# EAGLE design MagSwitchRev1_1 (EAGLE 7.2.0)
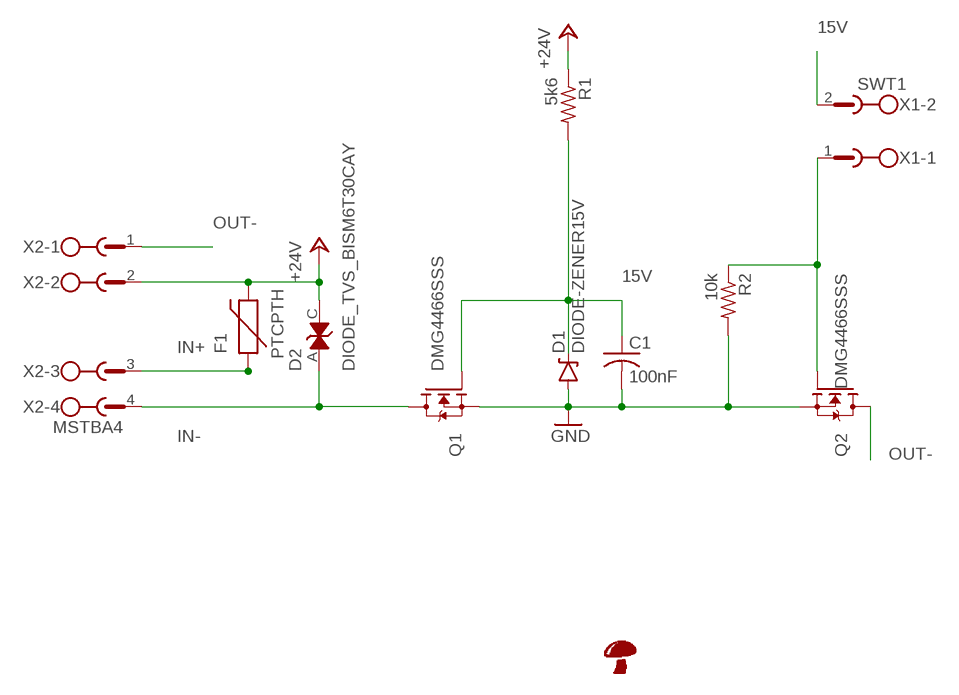
[diagram p0: schematic, sheet 1]

## Parts
C1  100nF  C-USC0805  [C0805]
D1  DIODE-ZENER15V  [SOD-323]
D2  DIODE_TVS_BISM6T30CAY  [SMB-DIODE]
F1  PTCPTH  [PTC]
Q1  DMG4466SSS  [SO08]
Q2  DMG4466SSS  [SO08]
R1  5k6  R-US_M0805  [M0805]
R2  10k  R-US_M0805  [M0805]
U$4  SHROOM5MM  [SHROOM]
X1  SWT1  MSTBA2  [MSTBA2]
X2  MSTBA4  [MSTBA4]

## Nets
15V: C1.1 D1.C Q1.4(G) R1.2 X1.2
+24V: D2.C F1.P$2 R1.1 X2.2
GND: C1.2 D1.A Q1.1(S) Q1.2(S) Q1.3(S) Q2.1(S) Q2.2(S) Q2.3(S) R2.2
IN+: F1.P$1 X2.3
IN-: D2.A Q1.5(D) Q1.6(D) Q1.7(D) Q1.8(D) X2.4
N$4: Q2.4(G) R2.1 X1.1
OUT-: Q2.5(D) Q2.6(D) Q2.7(D) Q2.8(D) X2.1

## Library data of the parts
C1 = resistor:C-US: CAPACITOR, American symbol
D1 = RobThePyro:DIODE-ZENER: ON Semiconductor MM3Z15VST1G Zener Diode, 15V 300 mW SMT 2-Pin SOD-323 RS stock no.802-4568ManufacturerON Semiconductor Mfr. Part No.MM3Z15VST1G
D2 = RobThePyro:DIODE_TVS_BI: STMicroelectronics SM6T30CAY Bi-Directional TVS Diode, 600W peak, 2-Pin DO-214AA RS stock no. 795-8877 Brand STMicroelectronics Mfr. Part No. SM6T30CAY
F1 = SparkFun-PowerIC:PTC: Resettable Fuse PTC Resettable Fuse. Spark Fun Electronics SKU : COM-08357
Q1 Q2 = RobThePyro:DMG4466SSS
R1 R2 = resistor:R-US_: RESISTOR, American symbol
U$4 = RobThePyro:SHROOM
X1 = con-phoenix-508:MSTBA2: PHOENIX; MF: FARNELL; MPN: 1757242; OC_FARNELL: 3705171; OC_NEWARK: 71C4161
X2 = con-phoenix-508:MSTBA4: PHOENIX; MF: FARNELL; MPN: 1757268; OC_FARNELL: 3705195; OC_NEWARK: 71C4163

## Board
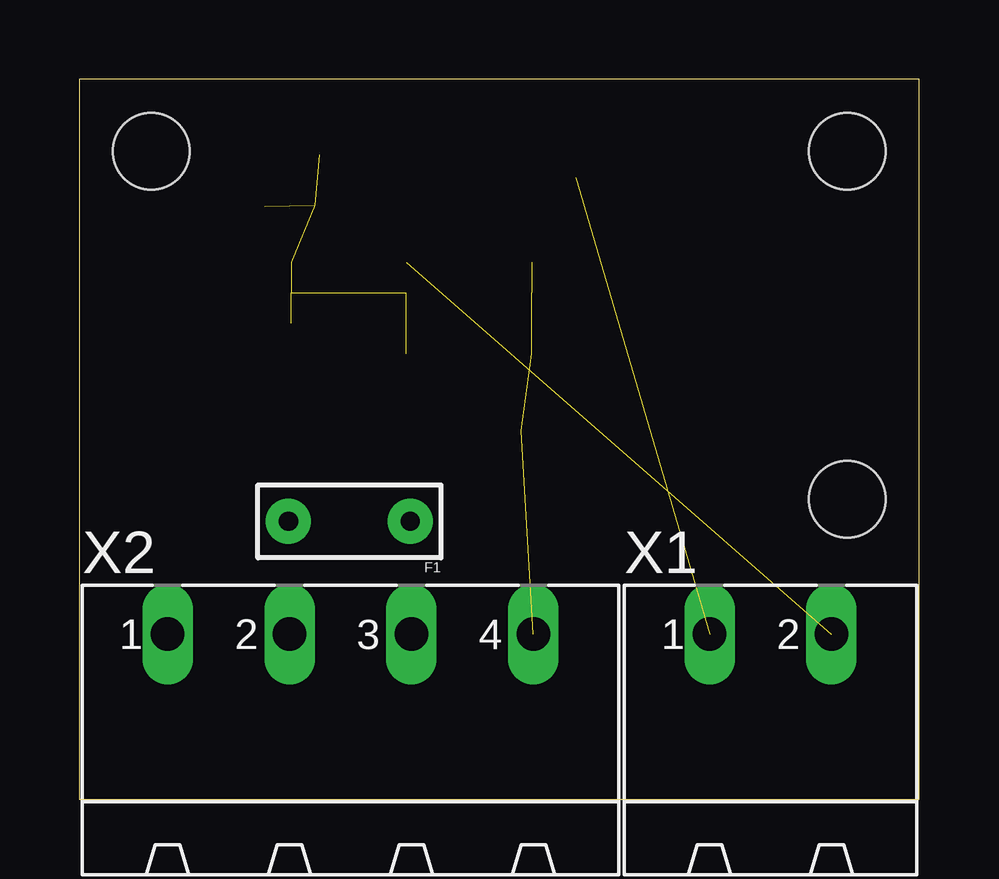
[diagram p1: board, top side]
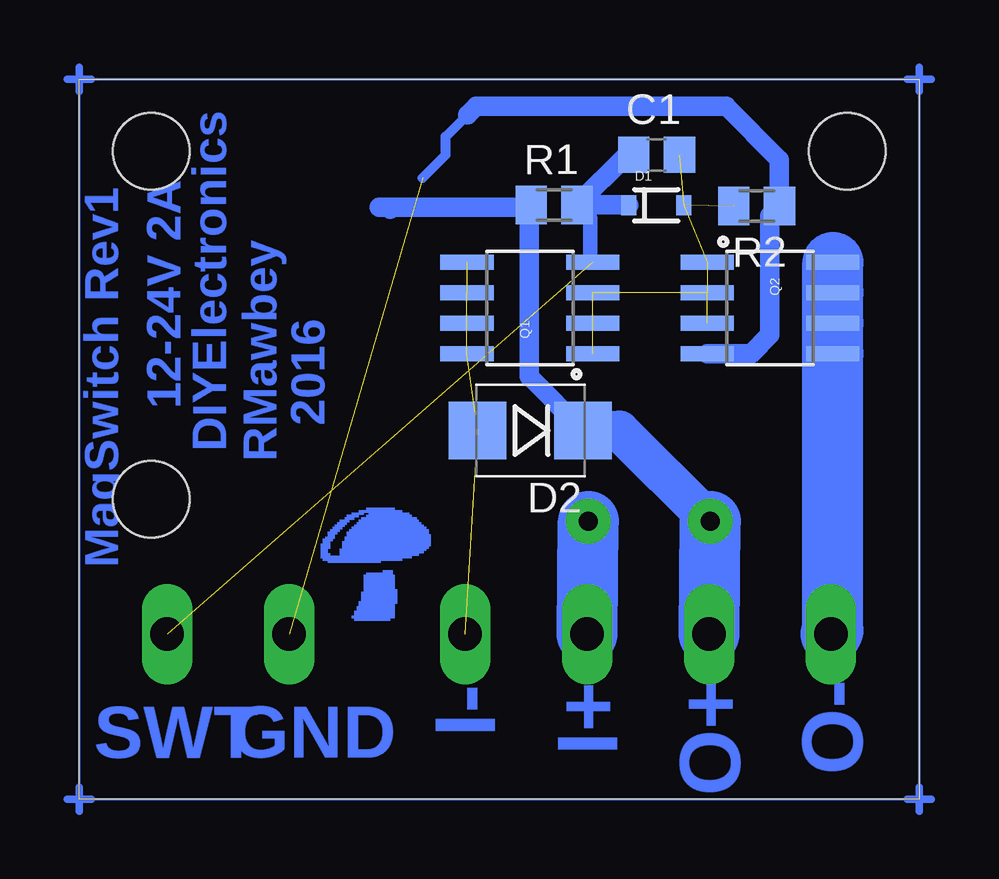
[diagram p2: board, bottom side, seen from below]

Size 35 x 30 mm. Coordinates in mm from the lower left corner, seen from the top.
Outline: 0,0 35,0 35,30 0,30 0,0
Copper layers (1*16): Top 0.035mm / dielectric 1.5mm / Bottom 0.035mm
Design rules "default": minimum track width 10mil, minimum drill 24mil, track to track 8mil, track to pad 8mil, pad to pad 8mil, via to via 8mil, smd to smd 8mil, copper to edge 40mil, drill to drill 8mil, minimum pad ring 10mil, minimum via ring 8mil, stop-mask expansion 4mil, vias tented up to drill 0mil, thermal gap 10mil
Holes 3.2 mm at 3,27 32,27 32,12.5

### Footprints (pad centres in the part's own frame; a part is rotated, then mirrored left to right if it is on the bottom)
C0805 = smd 1.3 x 1.5: 1 -0.95,0; 2 0.95,0
SOD-323 = smd 0.63 x 0.83: A 1.15,0; C -1.15,0
SMB-DIODE = smd 2.4 x 2.4: A 2.2,0; C -2.2,0
PTC = drill 0.8 pad 1.88: P$1 -2.54,0; P$2 2.54,0
SO08 = smd 0.61 x 2.21: 1 -1.905,-2.616; 2 -0.635,-2.616; 3 0.635,-2.616; 4 1.905,-2.616; 5 1.905,2.616; 6 0.635,2.616; 7 -0.635,2.616; 8 -1.905,2.616
M0805 = smd 1.3 x 1.6: 1 -0.95,0; 2 0.95,0
MSTBA2 = drill 1.397 long: 1 -2.54,5.08; 2 2.54,5.08
MSTBA4 = drill 1.397 long: 1 -7.62,5.08; 2 -2.54,5.08; 3 2.54,5.08; 4 7.62,5.08

### Placement (x,y rotation side)
C1  10.95,26.85 0 bottom
D1  10.96,24.75 0 bottom
D2  16.21,15.37 180 bottom
F1  11.25,11.58 180 top
Q1  16.23,20.47 90 bottom
Q2  6.22,20.47 270 bottom
R1  15.21,24.77 0 bottom
R2  6.78,24.72 180 bottom
U$4  25,7.5 0 bottom
X1  28.8,1.8 0 top
X2  11.3,1.8 0 top

### Tracks (layer width: path | path; a pad name or v marks a point on that pad's centre or on a via)
15V  (1 unrouted)
  Bottom 0.61: R1.2 13.72,24.22 13.72,22.48 Q1.4
  Bottom 0.813: D1.C 12.12,24.77 R1.2 12.18,26.85 C1.1
+24V
  Bottom 0.813: 16.26,24.67 R1.1 | 16.26,24.67 21.95,24.67 | 21.95,24.67 22.5,24.67 | 22.04,24.58 21.95,24.67 | 16.26,24.67 16.26,17.62 D2.C
  Bottom 1.676: D2.C 12.5,15.37 F1.P$2
  Bottom 2.54: X2.2 F1.P$2
GND  (8 unrouted)
IN+
  Bottom 2.54: X2.3 F1.P$1
IN-  (5 unrouted)
N$4  (1 unrouted)
  Bottom 0.406: 20.69,25.89 19.74,26.85 19.74,27.61 18.82,28.52
  Bottom 0.61: 8.83,18.55 Q2.4
  Bottom 0.813: 18.82,28.52 18.47,28.88 8.05,28.88 5.83,26.66 R2.1 6.22,24.32 6.22,19.36 7.01,18.57 Q2.4
N$5
  Bottom 0.1: 0,30 35,30 35,0 0,0 0,30
  Bottom 0.305: 0,29.5 0,30 0,30.5 | 35.5,0 35,0 34.5,0
N$8
  Bottom 0.305: -0.5,30 0.5,30
N$9
  Bottom 0.305: 35,29.5 35,30.5
N$10
  Bottom 0.305: 35.5,30 34.5,30
N$11
  Bottom 0.305: 0,0.5 0,-0.5
N$12
  Bottom 0.305: -0.5,0 0.5,0
N$14
  Bottom 0.305: 35,0.5 35,-0.5
OUT-
  Bottom 2.54: X2.1 3.61,7.03 Q2.5 Q2.6 Q2.7 Q2.8
(copper drawn outside any net)
  shapes: Bottom circle x3

### Text on the board
Bottom: DIYElectronics | 12-24V 2A | MagSwitch Rev1 | RMawbey | 2016 | O- | O+ | I+ | I- | GND | SWT